# Altium schematic sheet МПСУ.464421.22-01 RF_IN.SchDoc
size 297 x 209 mm; Address1: Address1; Address2: Address2; Address3: Address3; Address4: Address4; SheetNumber: 4; SheetTotal: 6; DocumentTypeSCH: Э3; DocumentName1SCH: Плата; NachOtdelaSCH: Орешкин; UtverjdenSCH: Утвержден
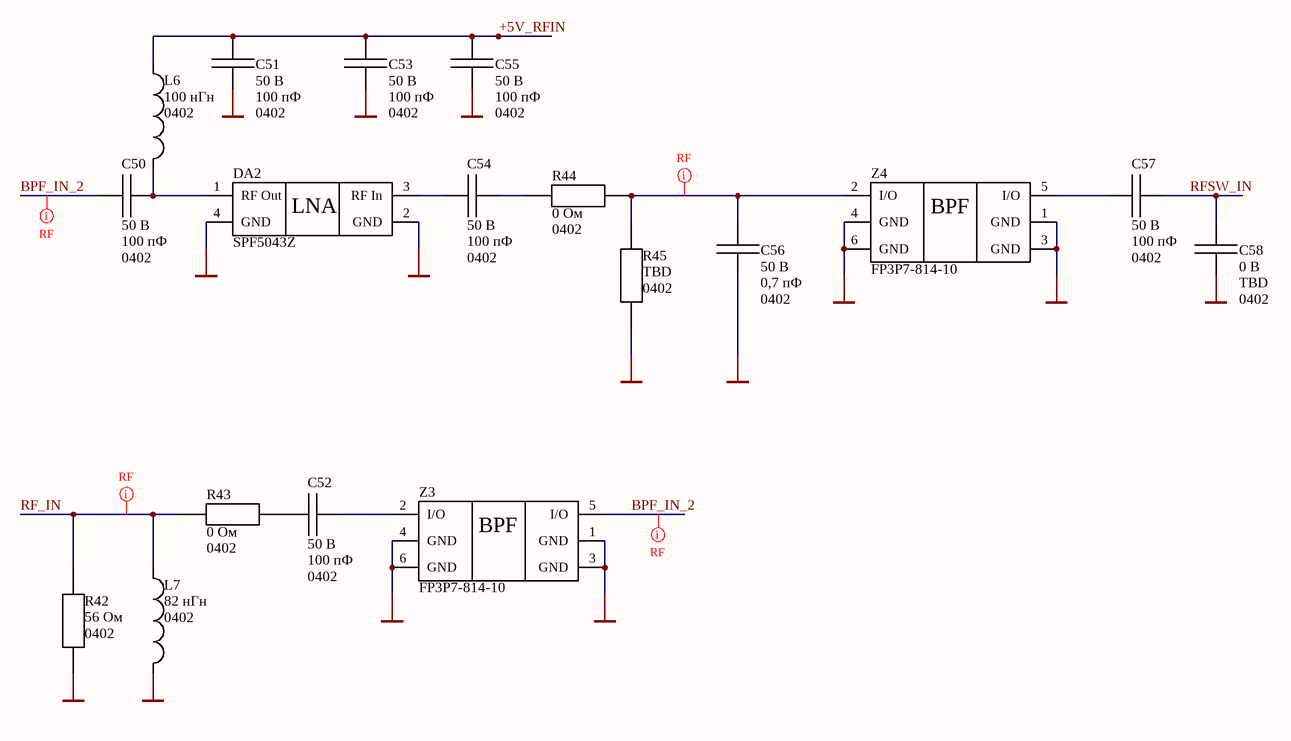
[diagram p0: МПСУ.464421.22-01 RF_IN.SchDoc]

## Parts
C50  value 100 пФ  Peak_Condition: 50 В  Package: 0402  [CAPC100X50X55L20N]  (hidden comment: 100 пФ ± 5 % 50 В C0G 0402 GRM1555C1H101JZ01D)
C51  value 100 пФ  Peak_Condition: 50 В  Package: 0402  [CAPC100X50X55L20N]  (hidden comment: 100 пФ ± 5 % 50 В C0G 0402 GRM1555C1H101JZ01D)
C52  value 100 пФ  Peak_Condition: 50 В  Package: 0402  [CAPC100X50X55L20N]  (hidden comment: 100 пФ ± 5 % 50 В C0G 0402 GRM1555C1H101JZ01D)
C53  value 100 пФ  Peak_Condition: 50 В  Package: 0402  [CAPC100X50X55L20N]  (hidden comment: 100 пФ ± 5 % 50 В C0G 0402 GRM1555C1H101JZ01D)
C54  value 100 пФ  Peak_Condition: 50 В  Package: 0402  [CAPC100X50X55L20N]  (hidden comment: 100 пФ ± 5 % 50 В C0G 0402 GRM1555C1H101JZ01D)
C55  value 100 пФ  Peak_Condition: 50 В  Package: 0402  [CAPC100X50X55L20N]  (hidden comment: 100 пФ ± 5 % 50 В C0G 0402 GRM1555C1H101JZ01D)
C56  value 0,7 пФ  Peak_Condition: 50 В  Package: 0402  [CAPC100X50X55L20N]  (hidden comment: 0,7 пФ ± 0,05 пФ 50 В C0G 0402 GRM1555C1HR70WA01D)
C57  value 100 пФ  Peak_Condition: 50 В  Package: 0402  [CAPC100X50X55L20N]  (hidden comment: 100 пФ ± 5 % 50 В C0G 0402 GRM1555C1H101JZ01D)
C58  value TBD  Peak_Condition: 0 В  Package: 0402  [CAPC100X50X55L20N]  (hidden comment: TBD 0402)
DA2  SPF5043Z  [SOT130P210X100-4N]
L6  value 100 нГн  Package: 0402  [INDC100X50X60L10N]  (hidden comment: 100 нГн ± 5 % 200 мА 0402 LQG15HNR10J02D)
L7  value 82 нГн  Package: 0402  [INDC100X50X60L10N]  (hidden comment: 82 нГн ± 5 % 200 mA 0402 LQG15HN82NJ02D)
R42  value 56 Ом  Package: 0402  [RESC100X50X40L25N]  (hidden comment: 56 Ом ± 1 % 0 Вт 0402 CR-02FL6-56R)
R43  value 0 Ом  Package: 0402  [RESC100X50X40L25N]  (hidden comment: 0 Ом ± 5 % 0 Вт 0402 RI0402L000JT)
R44  value 0 Ом  Package: 0402  [RESC100X50X40L25N]  (hidden comment: 0 Ом ± 5 % 0 Вт 0402 RI0402L000JT)
R45  value TBD  Package: 0402  [RESC100X50X40L25N]  (hidden comment: TBD 0402)
Z3  FP3P7-814-10  [LCCS110P300X300X146-6N]
Z4  FP3P7-814-10  [LCCS110P300X300X146-6N]

## Nets
GND: C51.2 C53.2 C55.2 C56.1 C58.2 DA2.2(GND) DA2.4(GND) L7.2 R42.2 R45.2 Z3.1(GND) Z3.3(GND) Z3.4(GND) Z3.6(GND) Z4.1(GND) Z4.3(GND) Z4.4(GND) Z4.6(GND)
+5V_RFIN: C51.1 C53.1 C55.1 L6.1
BPF_IN_2: C50.1 Z3.5(I/O)
RF_IN: L7.1 R42.1 R43.2
RFSW_IN: C57.2 C58.1
NetC50_2: C50.2 DA2.1(RF_Out) L6.2
NetC52_1: C52.1 R43.1
NetC52_2: C52.2 Z3.2(I/O)
NetC54_1: C54.1 DA2.3(RF_In)
NetC54_2: C54.2 R44.2
NetC56_2: C56.2 R44.1 R45.1 Z4.2(I/O)
NetC57_1: C57.1 Z4.5(I/O)

## Layout directives
net class RF: BPF_IN_2, NetC56_2, RF_IN

## Notes on the sheet
- Подп. и дата
- Инв. № дубл.
- Взам. инв. №
- Инв. № подл.
- Изм.
- Лист
- № докум.
- Подп.
- Дата
- Копировал
- Формат А4
- (in symbol FP3P7-***-**) BPF

## Library data of the parts
C50-C55 C57 = C 0402: Capacitor 0402; Manufacturer: Murata; Tolerance: 5 %; Designer: Свидерский; 3D_Body: +; PartNumber: GRM1555C1H101JZ01D; Category: Passive; Subcategory: Capacitor; Dielectric: C0G; Status: Approved
C56 = C 0402: Capacitor 0402; Manufacturer: Murata; Tolerance: 0,05 пФ; Designer: Свидерский; 3D_Body: +; PartNumber: GRM1555C1HR70WA01D; Category: Passive; Subcategory: Capacitor; Dielectric: C0G; Status: Approved
C58 = C 0402: Capacitor 0402; Tolerance: 0 %; Designer: Свидерский; Notes: CP; 3D_Body: +; Category: Passive; Subcategory: Capacitor; Status: Approved
DA2 = SPF5043Z: 50 MHz to 4000 MHz Low-Noise Amplifier; Manufacturer: Qorvo; Designer: Лазба; 3D_Body: +; ComponentLink1Description: Техническое описание; ComponentLink1URL: Q:\Libs\Descriptions_PDF\SPF5043Z Data Sheet.pdf; Category: IC; Subcategory: LNA; Status: Check; Package: SOT343; PartNumber: SPF5043Z
L6 = L 0402: Inductor 0402; Manufacturer: Murata; Designer: Свидерский; 3D_Body: +; Tolerance: 5 %; Peak_Condition: 200 мА; PartNumber: LQG15HNR10J02D; Category: Passive; Subcategory: Inductor; Status: Approved
L7 = L 0402: Inductor 0402; Manufacturer: Murata; Designer: Свидерский; 3D_Body: +; Tolerance: 5 %; Peak_Condition: 200 mA; PartNumber: LQG15HN82NJ02D; Category: Passive; Subcategory: Inductor; Status: Approved
R42 = R 0402: Resistor 0402; Manufacturer: Viking Tech; Designer: Свидерский; 3D_Body: +; Tolerance: 1 %; Peak_Condition: 0 Вт; PartNumber: CR-02FL6-56R; Category: Passive; Subcategory: Resistor; Status: Approved
R43 R44 = R 0402: Resistor 0402; Manufacturer: Hottech; Designer: Свидерский; 3D_Body: +; Tolerance: 5 %; Peak_Condition: 0 Вт; PartNumber: RI0402L000JT; Category: Passive; Subcategory: Resistor; Status: Approved
R45 = R 0402: Resistor 0402; Designer: Свидерский; Notes: CP; 3D_Body: +; Tolerance: 0 %; Peak_Condition: 0 Вт; Category: Passive; Subcategory: Resistor; Status: Approved
Z3 Z4 = FP3P7-***-**: BandPass Filter; Manufacturer: БУТИС; Designer: Лазба; 3D_Body: +; ComponentLink1Description: Техническое описание; ComponentLink1URL: Q:\Libs\Descriptions_PDF\FP3P7-814-10.pdf; Category: Passive; Subcategory: Filter; Status: Check; Package: SMD 3,0x3,0; PartNumber: FP3P7-814-10